# Altium schematic sheet Power_2.schdoc: TEBF0808 - Power
size A4; DocumentNumber: TEBF0808; Revision: 04; SheetNumber: 32; SheetTotal: 36; Date: 2016-09-29; CompanyName: Trenz Electronic GmbH; Organization: Trenz Electronic GmbH
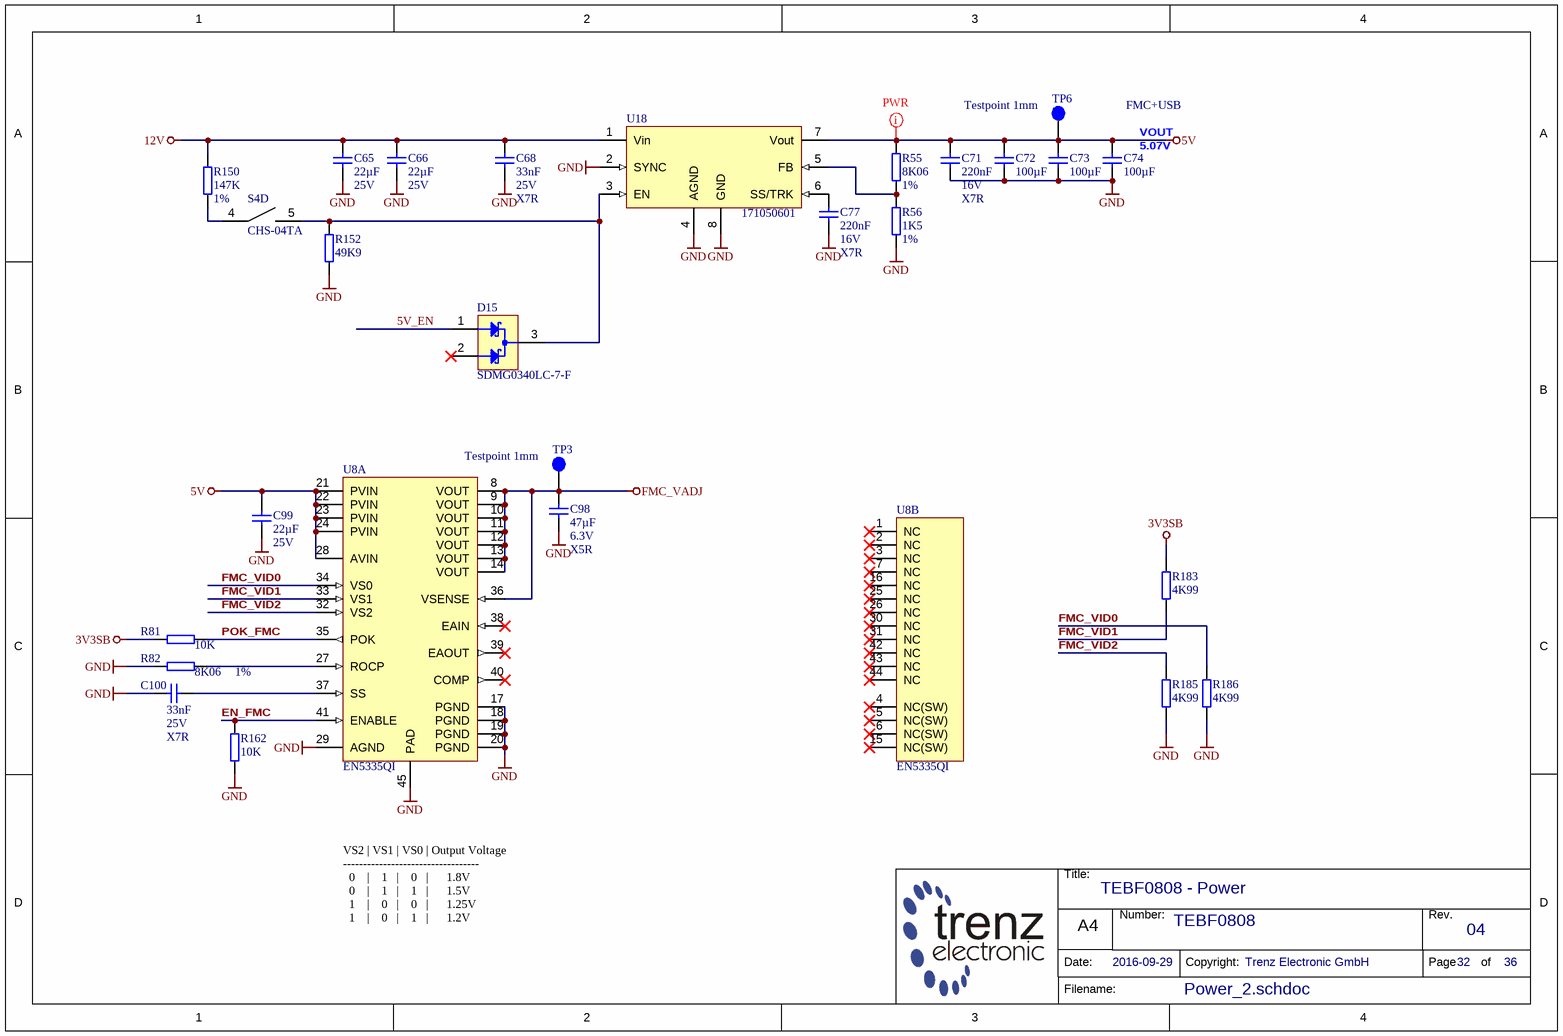
[diagram p0: Power_2.schdoc]

## Parts
C65  22µF  Voltage: 25V  [CAPC3216X180N]
C66  22µF  Voltage: 25V  [CAPC3216X180N]
C68  33nF  Voltage: 25V  Technology: X7R  [CAPC1005X55N]
C71  220nF  Voltage: 16V  Technology: X7R  [CAPC1005X55N]
C72  100µF  [CAPC3216X180N]
C73  100µF  [CAPC3216X180N]
C74  100µF  [CAPC3216X180N]
C77  220nF  Voltage: 16V  Technology: X7R  [CAPC1005X55N]
C98  47µF  Voltage: 6.3V  Technology: X5R  [CAPC3216X180N]
C99  22µF  Voltage: 25V  [CAPC3216X180N]
C100  33nF  Voltage: 25V  Technology: X7R  [CAPC1005X55N]
D15  SDMG0340LC-7-F  [SOT65P210X110-3N]
R55  8K06  Tolerance: 1%  [RESC1005X40N]
R56  1K5  Tolerance: 1%  [RESC1005X40N]
R81  10K  [RESC1005X40N]
R82  8K06  Tolerance: 1%  [RESC1005X40N]
R150  147K  Tolerance: 1%  [RESC1005X40N]
R152  49K9  [RESC1005X40N]
R162  10K  [RESC1005X40N]
R183  4K99  [RESC1005X40N]
R185  4K99  [RESC1005X40N]
R186  4K99  [RESC1005X40N]
S4  CHS-04TA  [CHS-04TA]  (part D of 4)
TP3  Testpoint 1mm  [TP_1mm]
TP6  Testpoint 1mm  [TP_1mm]
U8  EN5335QI  [EN5335QI]  (parts A,B of 2)
U18  171050601  [7TO-PMOD]

## Nets
3V3SB: R81.1 R183.1
5V: C71.1 C72.1 C73.1 C74.1 C99.2 R55.1 TP6.1 U8.21(PVIN) U8.22(PVIN) U8.23(PVIN) U8.24(PVIN) U8.28(AVIN) U18.7(Vout)
12V: C65.2 C66.2 C68.1 R150.2 U18.1(Vin)
FMC_VADJ: C98.1 TP3.1 U8.8(VOUT) U8.9(VOUT) U8.10(VOUT) U8.11(VOUT) U8.12(VOUT) U8.13(VOUT) U8.14(VOUT) U8.36(VSENSE)
GND: C65.1 C66.1 C68.2 C71.2 C72.2 C73.2 C74.2 C77.2 C98.2 C99.1 C100.1 R56.2 R82.1 R152.2 R162.1 R185.2 R186.2 U8.17(PGND) U8.18(PGND) U8.19(PGND) U8.20(PGND) U8.29(AGND) U8.45(PAD) U18.2(SYNC) U18.4(AGND) U18.8(GND)
5V_EN: D15.1(A)
EN_FMC: R162.2 U8.41(ENABLE)
FMC_VID0: R186.1 U8.34(VS0)
FMC_VID1: R183.2 U8.33(VS1)
FMC_VID2: R185.1 U8.32(VS2)
POK_FMC: R81.2 U8.35(POK)
NetC77_1: C77.1 U18.6(SS/TRK)
NetC100_2: C100.2 U8.37(SS)
NetD15_3: D15.3(K) R152.1 S4.5 U18.3(EN)
NetR55_2: R55.2 R56.1 U18.5(FB)
NetR82_2: R82.2 U8.27(ROCP)
NetR150_1: R150.1 S4.4

Not connected (* = marked no-connect by the designer): D15 2(A)*; U8 1(NC)* 2(NC)* 3(NC)* 4(NC(SW))* 5(NC(SW))* 6(NC(SW))* 7(NC)* 15(NC(SW))* 16(NC)* 25(NC)* 26(NC)* 30(NC)* 31(NC)* 38(EAIN)* 39(EAOUT)* 40(COMP)* 42(NC)* 43(NC)* 44(NC)*

## Layout directives
net class PWR: 5V

## Notes on the sheet
- FMC+USB
- (near C74) 5.07V
- (near C74) VOUT
- VS2 | VS1 | VS0 | Output Voltage
  ----------------------------------
  0    |    1   |    0   |      1.8V
  0    |    1   |    1   |      1.5V
  1    |    0   |    0   |      1.25V
  1    |    0   |    1   |      1.2V
- Title:
- Number:
- Rev.
- Date:
- A4
- Copyright:
- Page
- of
- Filename:

## Library data of the parts
C65 C66 C99 = 24886: KON 22µF X5R 25V SMD 10%; AN: 24886; Value: 22u; Mixed: SMT; Preferred: Yes; Case: 3216 (1206); Tolerance: 10%
C68 C100 = 23916: KON 33nF 25V X7R SMD; AN: 23916; Value: 33n; Mixed: SMT; Preferred: Yes; Case: 1005 (0402)
C71 C77 = 22768: KON 220nF 16V X7R SMD; AN: 22768; Mixed: SMT; Value: 220n; Case: 1005 (0402)
C72-C74 = 23116: KON 100µF 6,3V X5R SMD 20%; AN: 23116; Mixed: SMT; Value: 100u; Preferred: Yes; Voltage: 6.3V; Case: 3216 (1206); Tolerance: 20%; Technology: X5R
C98 = 24557: KON 47µF 6.3V  X5R SMD 20%; AN: 24557; Value: 47u; Mixed: SMT; Preferred: Yes; Case: 3216 (1206); Tolerance: 20%
D15 = 25051: AN: 25051; Mixed: SMT; Trenz-Stock: Yes; Case: SC70-3 / SOT323; HelpURL: B:\AD\adlib\datasheet\SDMG0340; H-ART: SDMG0340LC-7-F
R55 = 25052: WID SMD 8K06 1% 0,063W; AN: 25052; Mixed: SMT; Value: 8.06K; Preferred: Yes; Case: 1005 (0402); Technology: TK100
R56 = 22602: WID SMD 1K5 1% 0,063W; AN: 22602; Mixed: SMT; Value: 1.5K; Preferred: Yes; Case: 1005 (0402); Technology: TK100
R81 R162 = 22750: WID SMD 10K 1% 0,063W; AN: 22750; Mixed: SMT; Preferred: Yes; Case: 1005 (0402); Value: 10K; Tolerance: 1%; Technology: TK100
R82 = 25052: WID SMD 8K06 1% 0,063W; AN: 25052; Value: 8.06K; Mixed: SMT; Preferred: Yes; Case: 1005 (0402); Technology: TK100
R150 = 26470: WID SMD 147K 1% 0,063W; AN: 26470; Mixed: SMT; Preferred: Yes; Case: 1005 (0402); Technology: TK100; Value: 147K
R152 = 24677: WID SMD 49K9 1% 0,063W; AN: 24677; Mixed: SMT; Value: 49.9K; Preferred: Yes; Tolerance: 1%; Case: 1005 (0402); Technology: TK100
R183 R185 R186 = 22754: WID SMD 4K99 1% 0,063W; AN: 22754; Value: 4.99K; Mixed: SMT; Preferred: Yes; Case: 1005 (0402); Tolerance: 1%; Technology: TK100
S4 = 23417: DIP Schalter 4 fach 1,27mm SMD; AN: 23417; Mixed: SMT; Trenz-Stock: Yes; HelpURL: B:\AD\adlib\datasheet\CHS; Preferred: Yes; H-ART: CHS-04TA
TP3 TP6 = 25063: AN: 25063; Mixed: SMT
U8 = 25127: AN: 25127; Trenz-Stock: Yes; Mixed: SMT; HelpURL: B:\AD\adlib\datasheet\EN5335QI; Preferred: Yes; H-ART: EN5335QI
U18 = 26051: AN: 26051; Mixed: SMT; Case: TO263-7EP; HelpURL: B:\AD\adlib\datasheet\171050601; H-ART: 171050601